# EAGLE design JTAG_Adapter V2 (EAGLE 5.11)
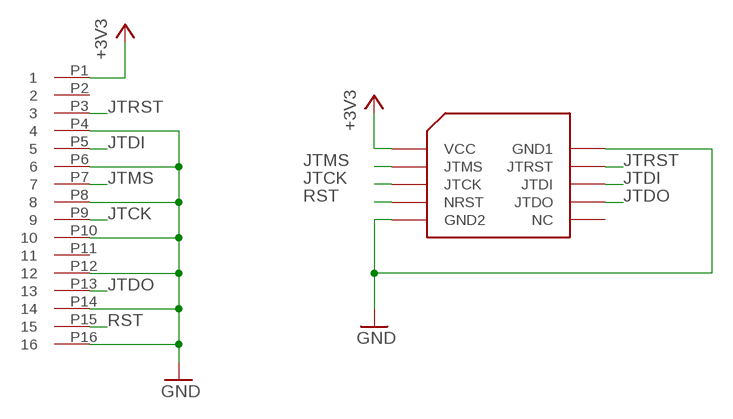
[diagram p0: schematic, sheet 1]

## Parts
U$2  IDC-DIP-2P16-EIDC-DIP-2P16-E  [IDC-DIP-2P16-E]
U$3  STM32-JTAG-10P  [STM32-JTAG-10P]

## Nets
+3V3: U$2.P1 U$3.P$1(VCC)
GND: U$2.P4 U$2.P6 U$2.P8 U$2.P10 U$2.P12 U$2.P14 U$2.P16 U$3.P$2(GND1) U$3.P$9(GND2)
JTCK: U$2.P9 U$3.P$5(JTCK)
JTDI: U$2.P5 U$3.P$6(JTDI)
JTDO: U$2.P13 U$3.P$8(JTDO)
JTMS: U$2.P7 U$3.P$3(JTMS)
JTRST: U$2.P3 U$3.P$4(JTRST)
RST: U$2.P15 U$3.P$7(NRST)
Unconnected: U$2.P2 U$2.P11 U$3.P$10(NC)

## Library data of the parts
U$2 = Pygmy:IDC-DIP-2P16-E
U$3 = Pygmy:STM32-JTAG-10P

## Board
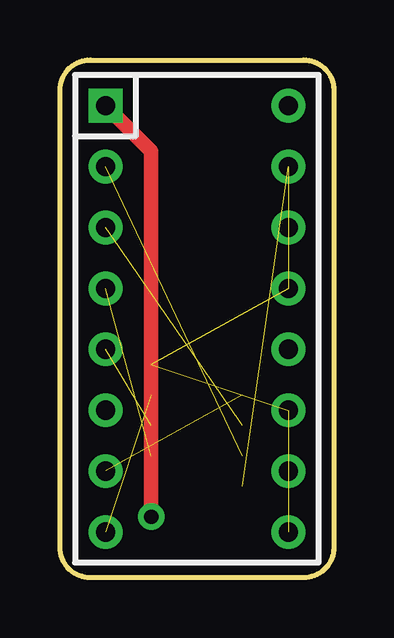
[diagram p1: board, top side]
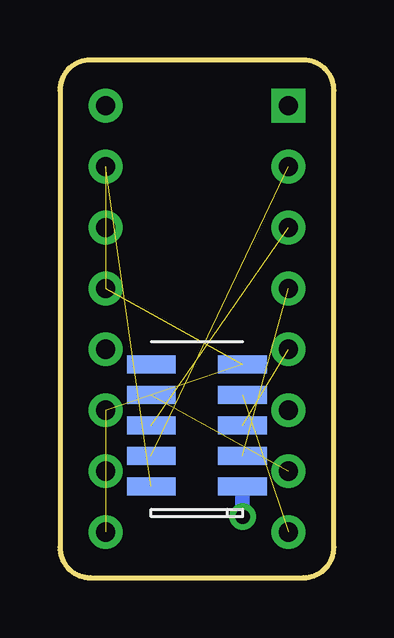
[diagram p2: board, bottom side, seen from below]

Size 11.43 x 21.59 mm. Coordinates in mm from the lower left corner, seen from the top.
Outline: 1.27,0 arc-90 0,1.27 0,20.32 arc-90 1.27,21.59 10.16,21.59 arc-90 11.43,20.32 11.43,1.27 arc-90 10.16,0 1.27,0
Copper layers (1*16): Top 0.035mm / dielectric 1.5mm / Bottom 0.035mm
Design rules "BatchPcb (Production)": minimum track width 8mil, minimum drill 20mil, track to track 8mil, track to pad 8mil, pad to pad 4mil, via to via 8mil, smd to smd 4mil, copper to edge 10mil, drill to drill 8mil, minimum pad ring 12mil, minimum via ring 10mil, stop-mask expansion 4mil, vias tented up to drill 25mil, thermal gap 10mil

### Footprints (pad centres in the part's own frame; a part is rotated, then mirrored left to right if it is on the bottom)
IDC-DIP-2P16-E = drill 0.8 square: P1 0,0 | drill 0.8 round: P2 7.62,0; P3 0,-2.54; P4 7.62,-2.54; P5 0,-5.08; P6 7.62,-5.08; P7 0,-7.62; P8 7.62,-7.62; P9 0,-10.16; P10 7.62,-10.16; P11 0,-12.7; P12 7.62,-12.7; P13 0,-15.24; P14 7.62,-15.24; P15 0,-17.78; P16 7.62,-17.78
STM32-JTAG-10P = smd 0.762 x 2.032: P$1 0,0; P$2 0,3.81; P$3 1.27,0; P$4 1.27,3.81; P$5 2.54,0; P$6 2.54,3.81; P$7 3.81,0; P$8 3.81,3.81; P$9 5.08,0; P$10 5.08,3.81

### Placement (x,y rotation side)
U$2  1.91,19.68 0 top
U$3  3.81,3.81 90 bottom

### Tracks (layer width: path | path; a pad name or v marks a point on that pad's centre or on a via)
+3V3  (via drill 0.6)
  Top 0.61: v3.81,2.54 3.81,17.78 U$2.P1
  Bottom 0.61: U$3.P$1 v3.81,2.54
GND  (8 unrouted)
JTCK  (1 unrouted)
JTDI  (1 unrouted)
JTDO  (1 unrouted)
JTMS  (1 unrouted)
JTRST  (1 unrouted)
RST  (1 unrouted)